# Altium schematic sheet 65_100M-RTL8201.SchDoc: P30L
size A2; Organization: 六零加智能科技; Address4: www.nidone.com.cn; DocumentNumber: Kangjin; Revision: 1.0; SheetNumber: 20; SheetTotal: 23
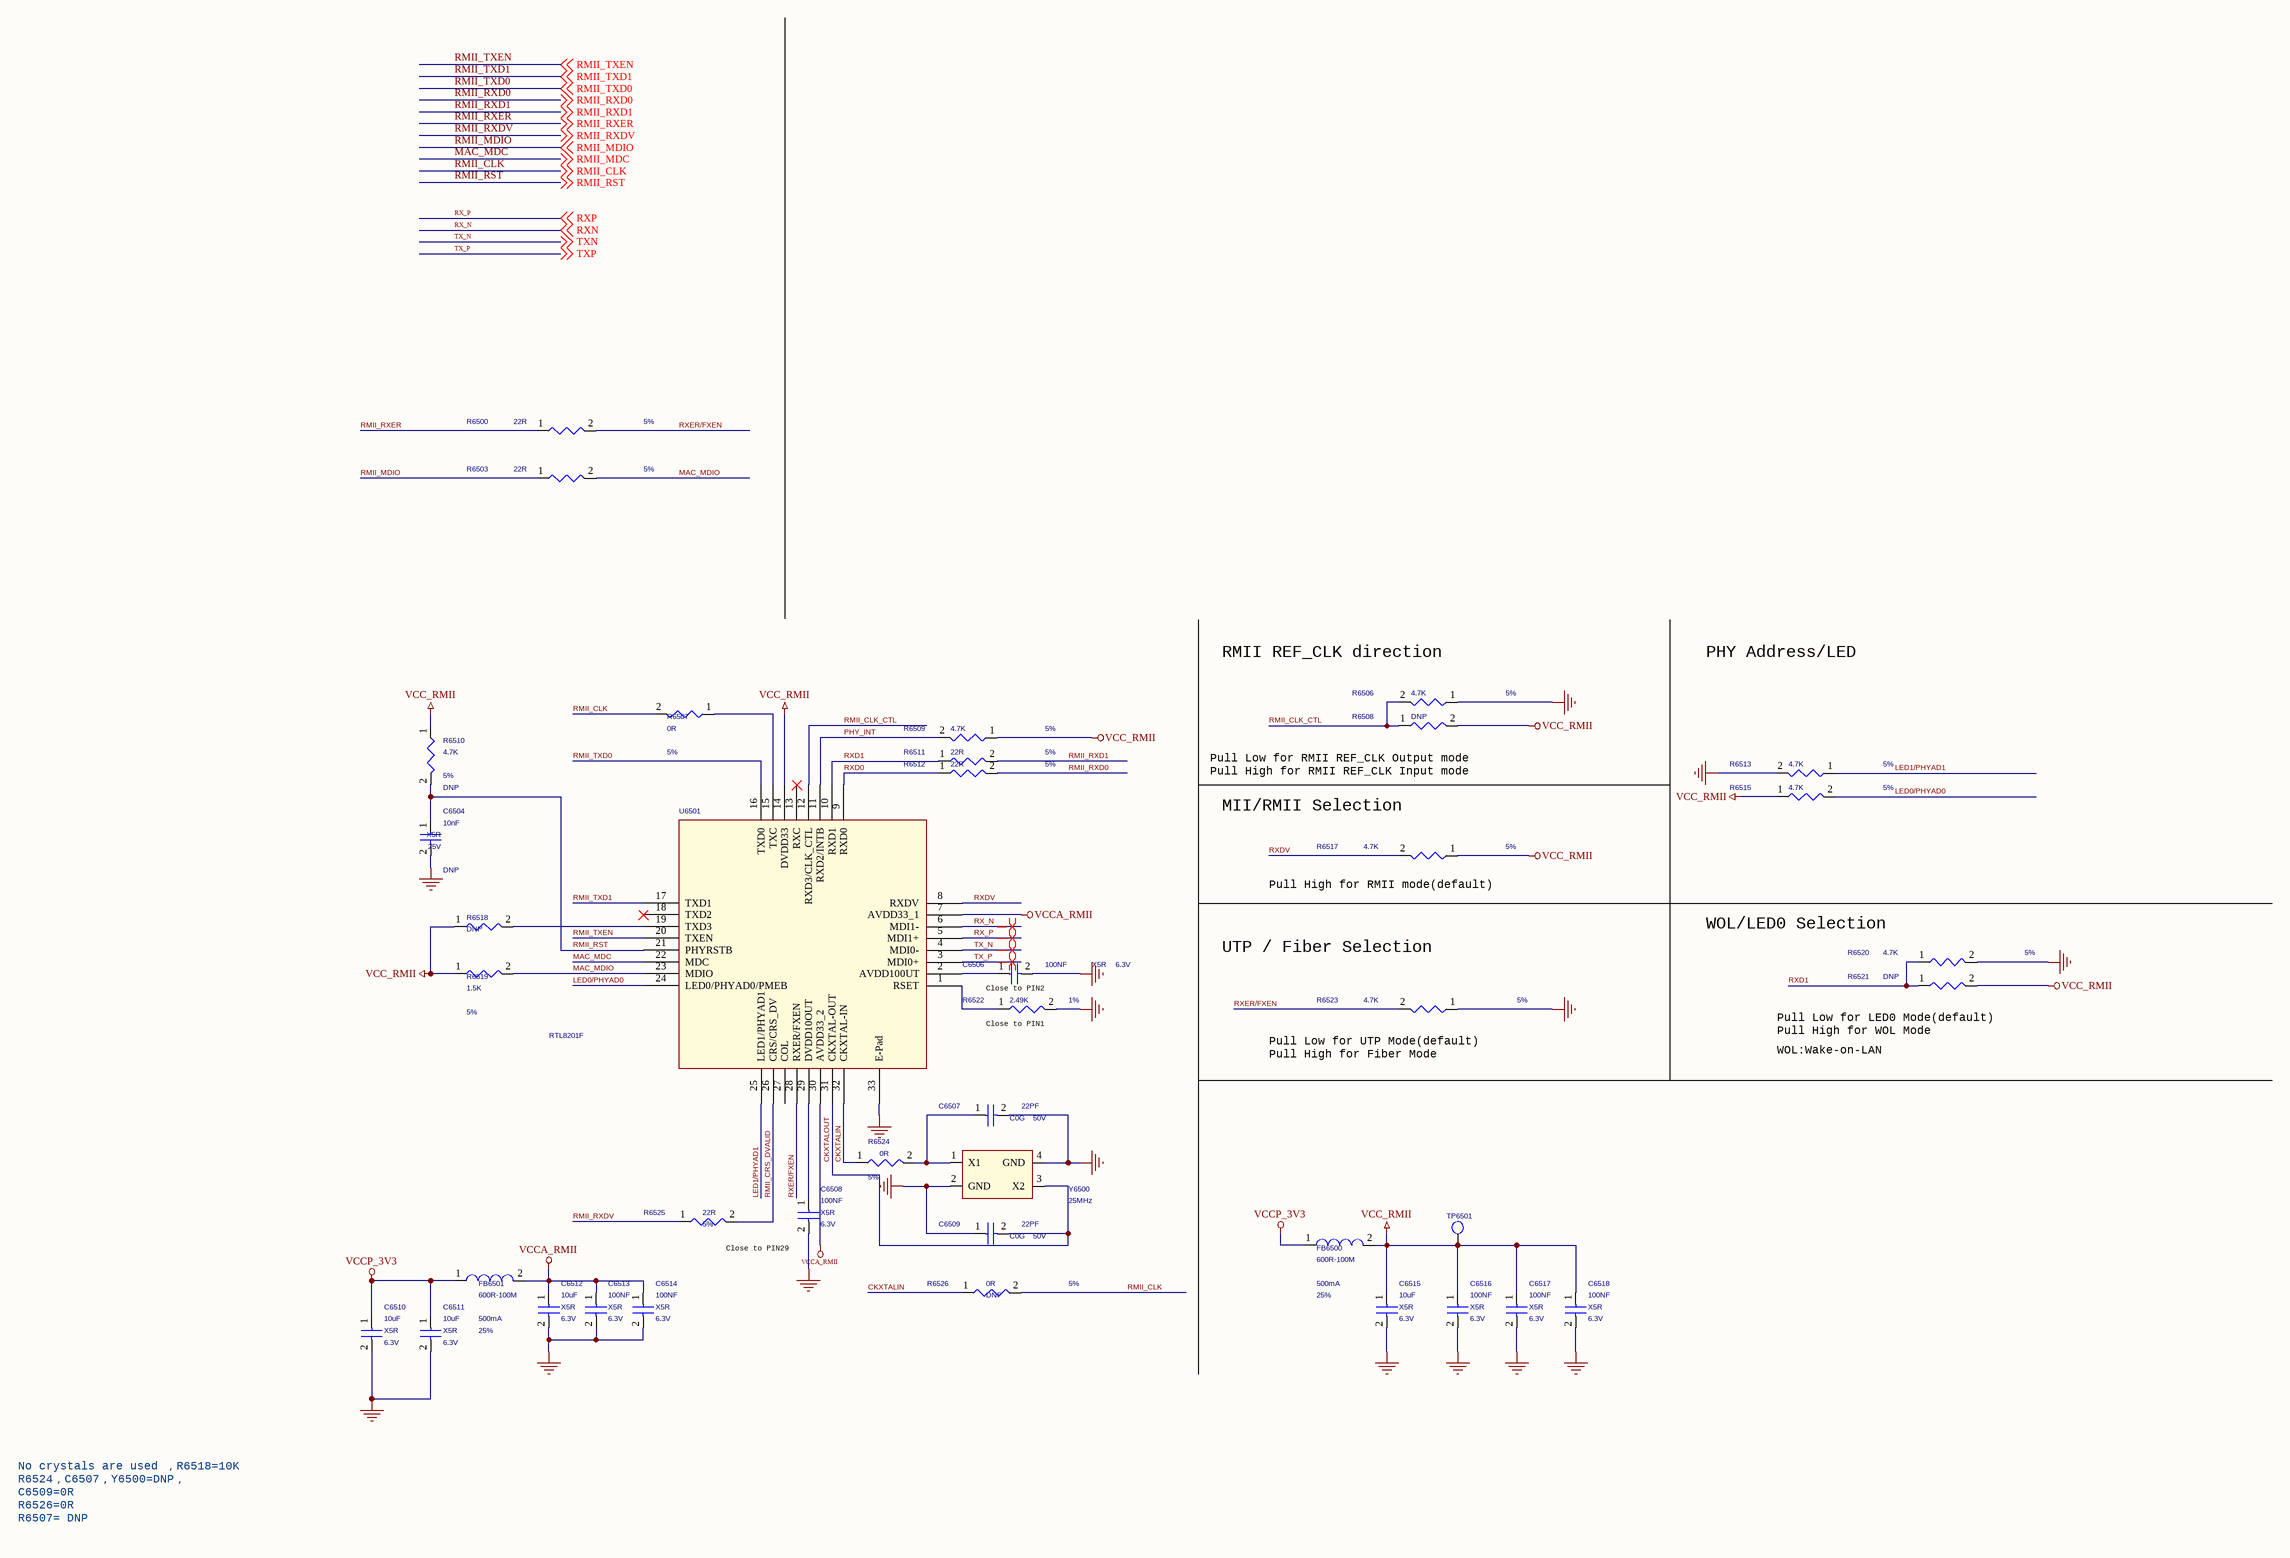
[diagram p0: 65_100M-RTL8201.SchDoc]

## Parts
C6504  10nF  Voltage: 25V  Dielectric: X5R  Option: DNP  [C0402]
C6506  100NF  Voltage: 6.3V  Dielectric: X5R  [C0402]
C6507  22PF  Voltage: 50V  Dielectric: C0G  [C0402]
C6508  100NF  Voltage: 6.3V  Dielectric: X5R  [C0402]
C6509  22PF  Voltage: 50V  Dielectric: C0G  [C0402]
C6510  10uF  Voltage: 6.3V  Dielectric: X5R  [C0603]
C6511  10uF  Voltage: 6.3V  Dielectric: X5R  [C0603]
C6512  10uF  Voltage: 6.3V  Dielectric: X5R  [C0603]
C6513  100NF  Voltage: 6.3V  Dielectric: X5R  [C0402]
C6514  100NF  Voltage: 6.3V  Dielectric: X5R  [C0402]
C6515  10uF  Voltage: 6.3V  Dielectric: X5R  [C0603]
C6516  100NF  Voltage: 6.3V  Dielectric: X5R  [C0402]
C6517  100NF  Voltage: 6.3V  Dielectric: X5R  [C0402]
C6518  100NF  Voltage: 6.3V  Dielectric: X5R  [C0402]
FB6500  600R-100M  Irms: 500mA  Tolerance: 25%  [L0603]
FB6501  600R-100M  Irms: 500mA  Tolerance: 25%  [L0603]
R6500  22R  Tolerance: 5%  [R0402]
R6503  22R  Tolerance: 5%  [R0402]
R6506  4.7K  Tolerance: 5%  [R0402]
R6507  0R  Tolerance: 5%  [R0402]
R6508  DNP  [R0402]
R6509  4.7K  Tolerance: 5%  [R0402]
R6510  4.7K  Tolerance: 5%  Option: DNP  [R0402]
R6511  22R  Tolerance: 5%  [R0402]
R6512  22R  Tolerance: 5%  [R0402]
R6513  4.7K  Tolerance: 5%  [R0402]
R6515  4.7K  Tolerance: 5%  [R0402]
R6517  4.7K  Tolerance: 5%  [R0402]
R6518  DNP  [R0402]
R6519  1.5K  Tolerance: 5%  [R0402]
R6520  4.7K  Tolerance: 5%  [R0402]
R6521  DNP  [R0402]
R6522  2.49K  Tolerance: 1%  [R0402]
R6523  4.7K  Tolerance: 5%  [R0402]
R6524  0R  Tolerance: 5%  [R0402]
R6525  22R  Tolerance: 5%  [R0402]
R6526  0R  Tolerance: 5%  Option: DNP  [R0402]
TP6501  TP_0.7  [TEST]  (value not drawn)
U6501  RTL8201F  [QFN-32_5x5x05P]
Y6500  25MHz  [CRY-D3225]

## Nets
GND: C6504.2 C6506.2 C6507.2 C6508.2 C6509.1 C6510.2 C6511.2 C6512.2 C6513.2 C6514.2 C6515.2 C6516.2 C6517.2 C6518.2 R6506.1 R6513.2 R6520.2 R6522.2 R6523.1 U6501.33(E-Pad) Y6500.2(GND) Y6500.4(GND)
VCC_RMII: C6515.1 C6516.1 C6517.1 C6518.1 FB6500.2 R6508.2 R6509.1 R6510.1 R6515.1 R6517.1 R6518.1 R6519.1 R6521.2 TP6501.1 U6501.14(DVDD33)
VCCA_RMII: C6512.1 C6513.1 C6514.1 FB6501.2 U6501.7(AVDD33_1) U6501.30(AVDD33_2)
VCCP_3V3: C6510.1 C6511.1 FB6500.1 FB6501.1
CKXTALIN: R6524.1 R6526.1 U6501.32(CKXTAL-IN)
CKXTALOUT: C6509.2 U6501.31(CKXTAL-OUT) Y6500.3(X2)
LED0/PHYAD0: R6515.2 U6501.24(LED0/PHYAD0/PMEB)
LED1/PHYAD1: R6513.1 U6501.25(LED1/PHYAD1)
MAC_MDC: U6501.22(MDC) ; off-sheet RMII_MDC  [also labelled RMII_MDC]
MAC_MDIO: R6503.2 R6519.2 U6501.23(MDIO)
PHY_INT: R6509.2 U6501.11(RXD2/INTB)
RMII_CLK: R6507.2 R6526.2 ; off-sheet RMII_CLK
RMII_CLK_CTL: R6506.2 R6508.1 U6501.12(RXD3/CLK_CTL)
RMII_CRS_DVALID: R6525.2 U6501.26(CRS/CRS_DV)
RMII_MDIO: R6503.1 ; off-sheet RMII_MDIO
RMII_RST: C6504.1 R6510.2 U6501.21(PHYRSTB) ; off-sheet RMII_RST
RMII_RXD0: R6512.2 ; off-sheet RMII_RXD0
RMII_RXD1: R6511.2 ; off-sheet RMII_RXD1
RMII_RXDV: R6525.1 ; off-sheet RMII_RXDV
RMII_RXER: R6500.1 ; off-sheet RMII_RXER
RMII_TXD0: U6501.16(TXD0) ; off-sheet RMII_TXD0
RMII_TXD1: U6501.17(TXD1) ; off-sheet RMII_TXD1
RMII_TXEN: U6501.20(TXEN) ; off-sheet RMII_TXEN
RX_N: U6501.6(MDI1-) ; off-sheet RXN  [also labelled RXN]
RX_P: U6501.5(MDI1+) ; off-sheet RXP  [also labelled RXP]
RXD0: R6512.1 U6501.9(RXD0)
RXD1: R6511.1 R6520.1 R6521.1 U6501.10(RXD1)
RXDV: R6517.2 U6501.8(RXDV)
RXER/FXEN: R6500.2 R6523.2 U6501.28(RXER/FXEN)
TX_N: U6501.4(MDI0-) ; off-sheet TXN  [also labelled TXN]
TX_P: U6501.3(MDI0+) ; off-sheet TXP  [also labelled TXP]
NetC6506_1: C6506.1 U6501.2(AVDD100UT)
NetC6507_1: C6507.1 R6524.2 Y6500.1(X1)
NetC6508_1: C6508.1 U6501.29(DVDD10OUT)
NetR6507_1: R6507.1 U6501.15(TXC)
NetR6518_2: R6518.2 U6501.19(TXD3)
NetR6522_1: R6522.1 U6501.1(RSET)

Not connected (* = marked no-connect by the designer): U6501 13(RXC)* 18(TXD2)* 27(COL)

## Layout directives
differential pair: RX_N, RX_P, TX_N, TX_P

## Notes on the sheet
- RMII REF_CLK direction
- PHY Address/LED
- (near R6508) Pull Low for RMII REF_CLK Output mode
  Pull High for RMII REF_CLK Input mode
- MII/RMII Selection
- (near R6517) Pull High for RMII mode(default)
- WOL/LED0 Selection
- Close to PIN2
- UTP / Fiber Selection
- (near R6522) Close to PIN1
- (near R6521) Pull Low for LED0 Mode(default)
  Pull High for WOL Mode
- WOL:Wake-on-LAN
- (near R6523) Pull Low for UTP Mode(default)
  Pull High for Fiber Mode
- Close to PIN29
- No crystals are used ，R6518=10K
  R6524，C6507，Y6500=DNP，
  C6509=0R
  R6526=0R
  R6507= DNP
- Title
- Size:
- Date:
- File:
- A2
- Engineer:
- Time:
- Revision:
- Sheet
- of

## Library data of the parts
C6504 = CAP NP_Dup1: cap,10.00nF,+/-10%,25V,X5R,C0402; Manufacturer: TDK; RK PN: C1005X5R1E103K050BA; Priority: A; Tolerance: 10%; Part Type: C0402; C_Voltage: 25V; Manufacturer PN: C1005X5R1E103K050BA; Created by: JJJ
C6506 C6508 C6514 = CAP NP_Dup1: cap,100.00nF,+/-10%,6.3V,X5R,C0402; Manufacturer: TDK; RK PN: C1005X5R0J104K050BA; Priority: A; Tolerance: 10%; Part Type: C0402; Manufacturer PN: C1005X5R0J104K050BA; Created by: JJJ
C6507 = CAP NP_Dup1: cap,22.00pF,+/-2%,50V,C0G,C0402; Manufacturer: TDK; RK PN: C1005C0G1H220G050BA; Priority: A; Tolerance: 2%; Part Type: C0402; Manufacturer PN: C1005C0G1H220G050BA; Created by: JJJ
C6509 = CAP NP_Dup1: cap,22.00pF,+/-2%,50V,C0G,C0402; Manufacturer PN: C1005C0G1H220G050BA; Manufacturer: TDK; Tolerance: 2%; Priority: A; Created by: JJJ; Part Type: C0402; RK PN: C1005C0G1H220G050BA
C6510 C6515 = CAP NP_Dup1: cap,10.00uF,+/-10%,6.3V,X5R,C0603; Manufacturer PN: C1608X5R0J106K080AB; Manufacturer: TDK; Tolerance: 10%; Priority: A; Created by: JJJ; C_Voltage: 6.3V; Part Type: C0603; RK PN: C1608X5R0J106K080AB
C6511 C6512 = CAP NP_Dup1: cap,10.00uF,+/-10%,6.3V,X5R,C0603; Manufacturer: TDK; RK PN: C1608X5R0J106K080AB; Priority: A; Tolerance: 10%; Part Type: C0603; C_Voltage: 6.3V; Manufacturer PN: C1608X5R0J106K080AB; Created by: JJJ
C6513 C6516-C6518 = CAP NP_Dup1: cap,100.00nF,+/-10%,6.3V,X5R,C0402; Manufacturer PN: C1005X5R0J104K050BA; Manufacturer: TDK; Tolerance: 10%; Priority: A; Created by: JJJ; Part Type: C0402; RK PN: C1005X5R0J104K050BA
FB6500 = BEAD: Ferrite Bead,600R-100M,0.25,L0603; Manufacturer PN: BLM18EG601SN1; Manufacturer: Murata; DC Resistor: 0.35ohm; Priority: A; Created by: YTL; Part Type: BEAD; RK PN: BLM18EG601SN1
FB6501 = BEAD: Ferrite Bead,600R-100M,0.25,L0603; Manufacturer: Murata; DC Resistor: 0.35ohm; RK PN: BLM18EG601SN1; Priority: A; Part Type: BEAD; Manufacturer PN: BLM18EG601SN1; Created by: YTL
R6500 R6503 R6511 R6525 = RESISTOR_Dup1: 通用厚膜电阻,22R,+/-5%,R0402,1/16W.; Manufacturer: YAGEO; RK PN: RC0402JR-0722RL; Priority: A; Wattage: 1/16W; Part Type: 通用厚膜电阻; Manufacturer PN: RC0402JR-0722RL; Created by: YTL
R6506 R6510 R6517 R6520 = RESISTOR_Dup1: 通用厚膜电阻,4K7,+/-5%,R0402,1/16W.; Manufacturer: YAGEO; RK PN: RC0402JR-074K7L; Priority: A; Wattage: 1/16W; Part Type: 通用厚膜电阻; Manufacturer PN: RC0402JR-074K7L; Created by: YTL
R6507 R6526 = RESISTOR_Dup1: 通用厚膜电阻,0R,+/-5%,R0402,1/16W.; Manufacturer PN: RC0402JR-070RL; Manufacturer: YAGEO; Wattage: 1/16W; Priority: A; Created by: YTL; Part Type: 通用厚膜电阻; RK PN: RC0402JR-070RL
R6508 R6518 R6521 = RESISTOR_Dup1: Did Not Place.; RK PN: DNPR0402; Priority: A; Part Type: DNP; Manufacturer PN: DNPR0402; Created by: JJJ
R6509 R6513 R6515 R6523 = RESISTOR_Dup1: 通用厚膜电阻,4K7,+/-5%,R0402,1/16W.; Manufacturer PN: RC0402JR-074K7L; Manufacturer: YAGEO; Wattage: 1/16W; Priority: A; Created by: YTL; Part Type: 通用厚膜电阻; RK PN: RC0402JR-074K7L
R6512 = RESISTOR_Dup1: 通用厚膜电阻,22R,+/-5%,R0402,1/16W.; Manufacturer PN: RC0402JR-0722RL; Manufacturer: YAGEO; Wattage: 1/16W; Priority: A; Created by: YTL; Part Type: 通用厚膜电阻; RK PN: RC0402JR-0722RL
R6519 = RESISTOR_Dup1: 通用厚膜电阻,1K5,+/-5%,R0402,1/16W.; Manufacturer: YAGEO; RK PN: RC0402JR-071K5L; Priority: A; Wattage: 1/16W; Part Type: 通用厚膜电阻; Manufacturer PN: RC0402JR-071K5L; Created by: YTL
R6522 = RESISTOR_Dup1: 通用厚膜电阻,2K49,+/-1%,R0402,1/16W.; Manufacturer: YAGEO; RK PN: RC0402FR-072K49L; Priority: A; Wattage: 1/16W; Part Type: 通用厚膜电阻; Manufacturer PN: RC0402FR-072K49L; Created by: YTL
R6524 = RESISTOR_Dup1: 通用厚膜电阻,0R,+/-5%,R0402,1/16W.; Manufacturer: YAGEO; RK PN: RC0402JR-070RL; Priority: A; Wattage: 1/16W; Part Type: 通用厚膜电阻; Manufacturer PN: RC0402JR-070RL; Created by: YTL
TP6501 = TP: Test Point 0.7mm; RK PN: TESTPOINT_0R7; Priority: A; Part Type: TP; Created by: JJJ
U6501 = RTL8201F_0
Y6500 = CRYSTAL_4P: 无源晶振，25M，3225,±10ppm，10pF，Hosonic; Manufacturer: Hosonic(鸿星电子); RK PN: E3SB25.0000F10E11; Priority: A; Part Type: CRYSTAL; Manufacturer PN: E3SB25.0000F10E11; Created by: JJJ